# Altium schematic sheet RemoteOutlet.SchDoc: Remote Outlet
size B; DrawnBy: Levi Balling; Engineer: T. Rogers, L.Balling; Organization: U of U Computer Engineering; Address1: 50 S. Central Campus Dr.; Address2: Rm. 3280 MEB; Address3: Salt Lake City, UT; Address4: Australia 2086; Revision: 1; SheetNumber: 14; SheetTotal: 14; Website: www.eng.utah.edu/~lballing/SmartHome; Project: Smart Home; Description: This boad will run as a outlet alone(note not expected in project); ProjectName: Smart Home

## Notes on the sheet
- Date:
- Time:
- Engineer:
- Drawn By:
- Checked By:
- Title
- Size:
- File:
- B
- Number:
- Revision:
- Project:
- Sheet
- of
- Website: